# EAGLE schematic 2016 Vehicle Pedal and Dash Controller manufactured 2016-11-03 (EAGLE 7.7.0)
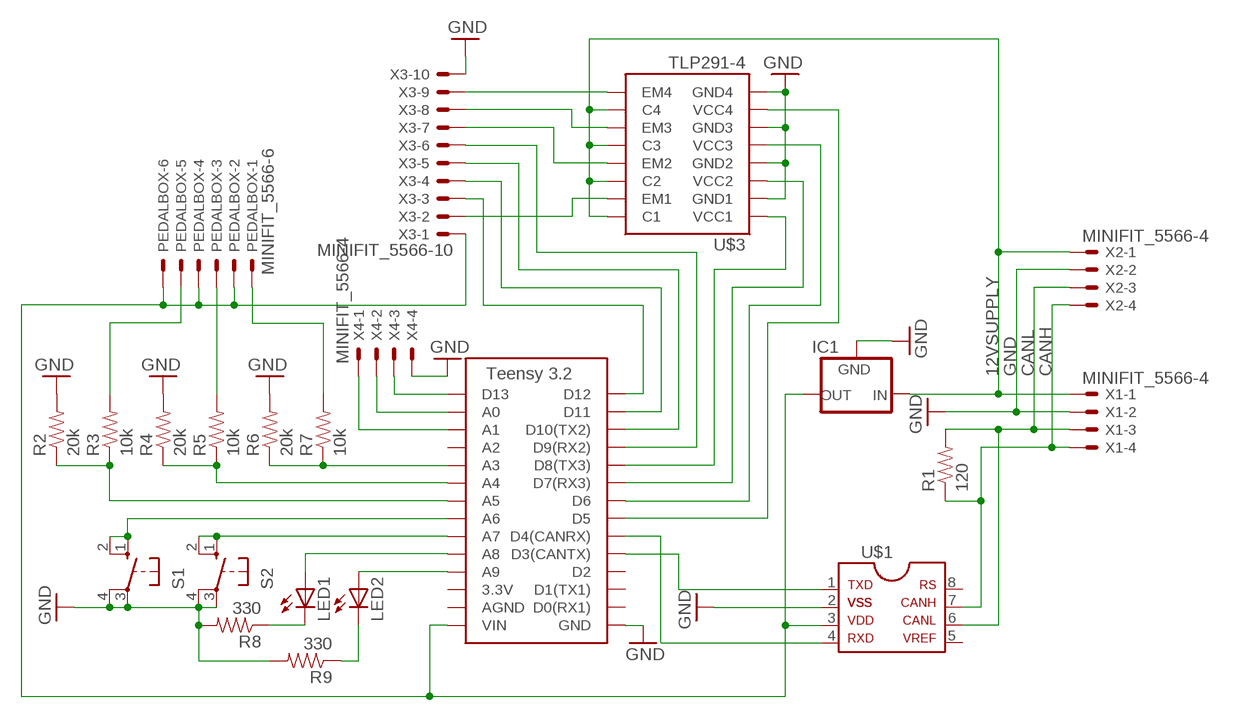
[diagram p0: schematic, sheet 1]

## Parts
IC1  5V_REGULATOR_LM340-NLM340MPX-5.0/NOPB  [SOT223]
LED1  LED-0805  [LED-805]
LED2  LED-0805  [LED-805]
PEDALBOX  MINIFIT_5566-6  [MINIFIT_5566-6]
R1  120  RESISTOR0805-RES  [0805]
R2  20k  RESISTOR0805-RES  [0805]
R3  10k  RESISTOR0805-RES  [0805]
R4  20k  RESISTOR0805-RES  [0805]
R5  10k  RESISTOR0805-RES  [0805]
R6  20k  RESISTOR0805-RES  [0805]
R7  10k  RESISTOR0805-RES  [0805]
R8  330  RESISTOR0805-RES  [0805]
R9  330  RESISTOR0805-RES  [0805]
S1  BTN_10-XX  [B3F-10XX]
S2  BTN_10-XX  [B3F-10XX]
U$1  MCP2551  [SOIC-08]
U$2  TEENSY_3.2_SIMPLE  [TEENSY_3.2_SIMPLE]
U$3  TLP291-4  [SOIC-16]
X1  MINIFIT_5566-4  [MINIFIT_5566-4]
X2  MINIFIT_5566-4  [MINIFIT_5566-4]
X3  MINIFIT_5566-10  [MINIFIT_5566-10]
X4  MINIFIT_5566-4  [MINIFIT_5566-4]

## Nets
12VSUPPLY: IC1.1(IN) U$3.10(C4) U$3.12(C3) U$3.14(C2) U$3.16(C1) X1.1 X2.1
CANH: R1.1 U$1.7 X1.4 X2.4
CANL: R1.2 U$1.6 X1.3 X2.3
GND: IC1.2(GND) IC1.4(GND) R2.2 R4.2 R6.2 R8.2 R9.2 S1.3(P) S1.4(P1) S2.3(P) S2.4(P1) U$1.2 U$2.GND U$3.2(GND1) U$3.4(GND2) U$3.6(GND3) U$3.8(GND4) X1.2 X2.2 X3.10 X4.4
N$1: U$2.D12 X3.3
N$2: IC1.3(OUT) PEDALBOX.2 PEDALBOX.4 PEDALBOX.6 U$1.3 U$2.VIN X3.1
N$3: PEDALBOX.5 R3.2
N$4: PEDALBOX.3 R5.2
N$5: U$1.1 U$2.D3(CANTX)
N$6: U$1.4 U$2.D4(CANRX)
N$7: PEDALBOX.1 R7.2
N$8: R2.1 R3.1 U$2.A5
N$9: R4.1 R5.1 U$2.A4
N$10: R6.1 R7.1 U$2.A3
N$11: U$2.D11 X3.4
N$12: U$2.D10(TX2) X3.5
N$13: U$2.D9(RX2) X3.6
N$14: U$2.D8(TX3) U$3.1(VCC1)
N$15: U$3.9(EM4) X3.9
N$16: U$3.11(EM3) X3.8
N$17: U$3.13(EM2) X3.7
N$18: U$3.15(EM1) X3.2
N$19: U$2.D7(RX3) U$3.3(VCC2)
N$20: U$2.D6 U$3.5(VCC3)
N$21: U$2.D5 U$3.7(VCC4)
N$22: S1.1(S) S1.2(S1) U$2.A6
N$23: S2.1(S) S2.2(S1) U$2.A7
N$24: LED1.A U$2.A8
N$25: LED2.A U$2.A9
N$26: LED1.C R8.1
N$27: LED2.C R9.1
N$28: U$2.D13 X4.3
N$29: U$2.A0 X4.2
N$30: U$2.A1 X4.1
Unconnected: U$1.5 U$1.8 U$2.3.3V U$2.A2 U$2.AGND U$2.D0(RX1) U$2.D1(TX1) U$2.D2

## Library data of the parts
IC1 = HyTechDevices:5V_REGULATOR_LM340-N: Voltage Regulator 5v linear voltage regulator Datasheet <http://www.mouser.com/ProductDetail/Texas-Instruments/LM340MPX-50-NOPB/?qs=X1J7HmVL2ZGZwtTFRQ9ItA%3D%3D> MAX current out: 1.5A MAX voltage in: 35V
LED1 LED2 = HyTechDevices:LED: Light Emitting Diode Source: Dangerous Prototypes Eagle Library <https://github.com/DangerousPrototypes/Eagle_Part_Library>
PEDALBOX = HyTechDevices:MINIFIT_5566-6: Mini FIT Junior connector 6 pole Source: http://www.molex.com; MPN: 95566-61002; OC_FARNELL: unknown; OC_NEWARK: 22K8620
R1-R9 = HyTechDevices:RESISTOR: Resistor Basic schematic elements and footprints for 0603, 1206, and PTH resistors.
S1 S2 = HyTechDevices:BTN_10-XX: OMRON SWITCH; MPN: B3F-1000; OC_FARNELL: 176432; OC_NEWARK: 36M3542
U$1 = HyTechDevices:MCP2551: MCP2551 High-Speed CAN Transceiver Product Webpage <https://www.microchip.com/wwwproducts/en/MCP2551> Datasheet <http://ww1.microchip.com/downloads/en/DeviceDoc/21667f.pdf> This device is outdated It is replaced by MCP2561. Comparison Page <https://www.microchip.com/wwwproducts/ProductCompare/MCP2551/MCP2561> Product Webpage <https://www.microchip.com/wwwproducts/en/MCP2561> Datasheet <http://ww1.microchip.com/downloads/en/DeviceDoc/20005167C.pdf>
U$2 = HyTechDevices:TEENSY_3.2_SIMPLE: Simple version of the Teensy 3.2 board that only uses the 2 main rows of pins, not the inner pins or the pins opposite the usb port.
U$3 = HyTechDevices:TLP291-4: Toshiba Quad Channel Optocoupler TLP291-4
X1 X2 X4 = HyTechDevices:MINIFIT_5566-4: Mini FIT Junior connector 4 pole Source: http://www.molex.com; OC_FARNELL: unknown; OC_NEWARK: unknown
X3 = HyTechDevices:MINIFIT_5566-10: Mini FIT Junior connector 10 pole Source: http://www.molex.com; OC_FARNELL: unknown; OC_NEWARK: unknown